# EAGLE design EVGP_Estop_Motherboard (EAGLE 9.5.1)
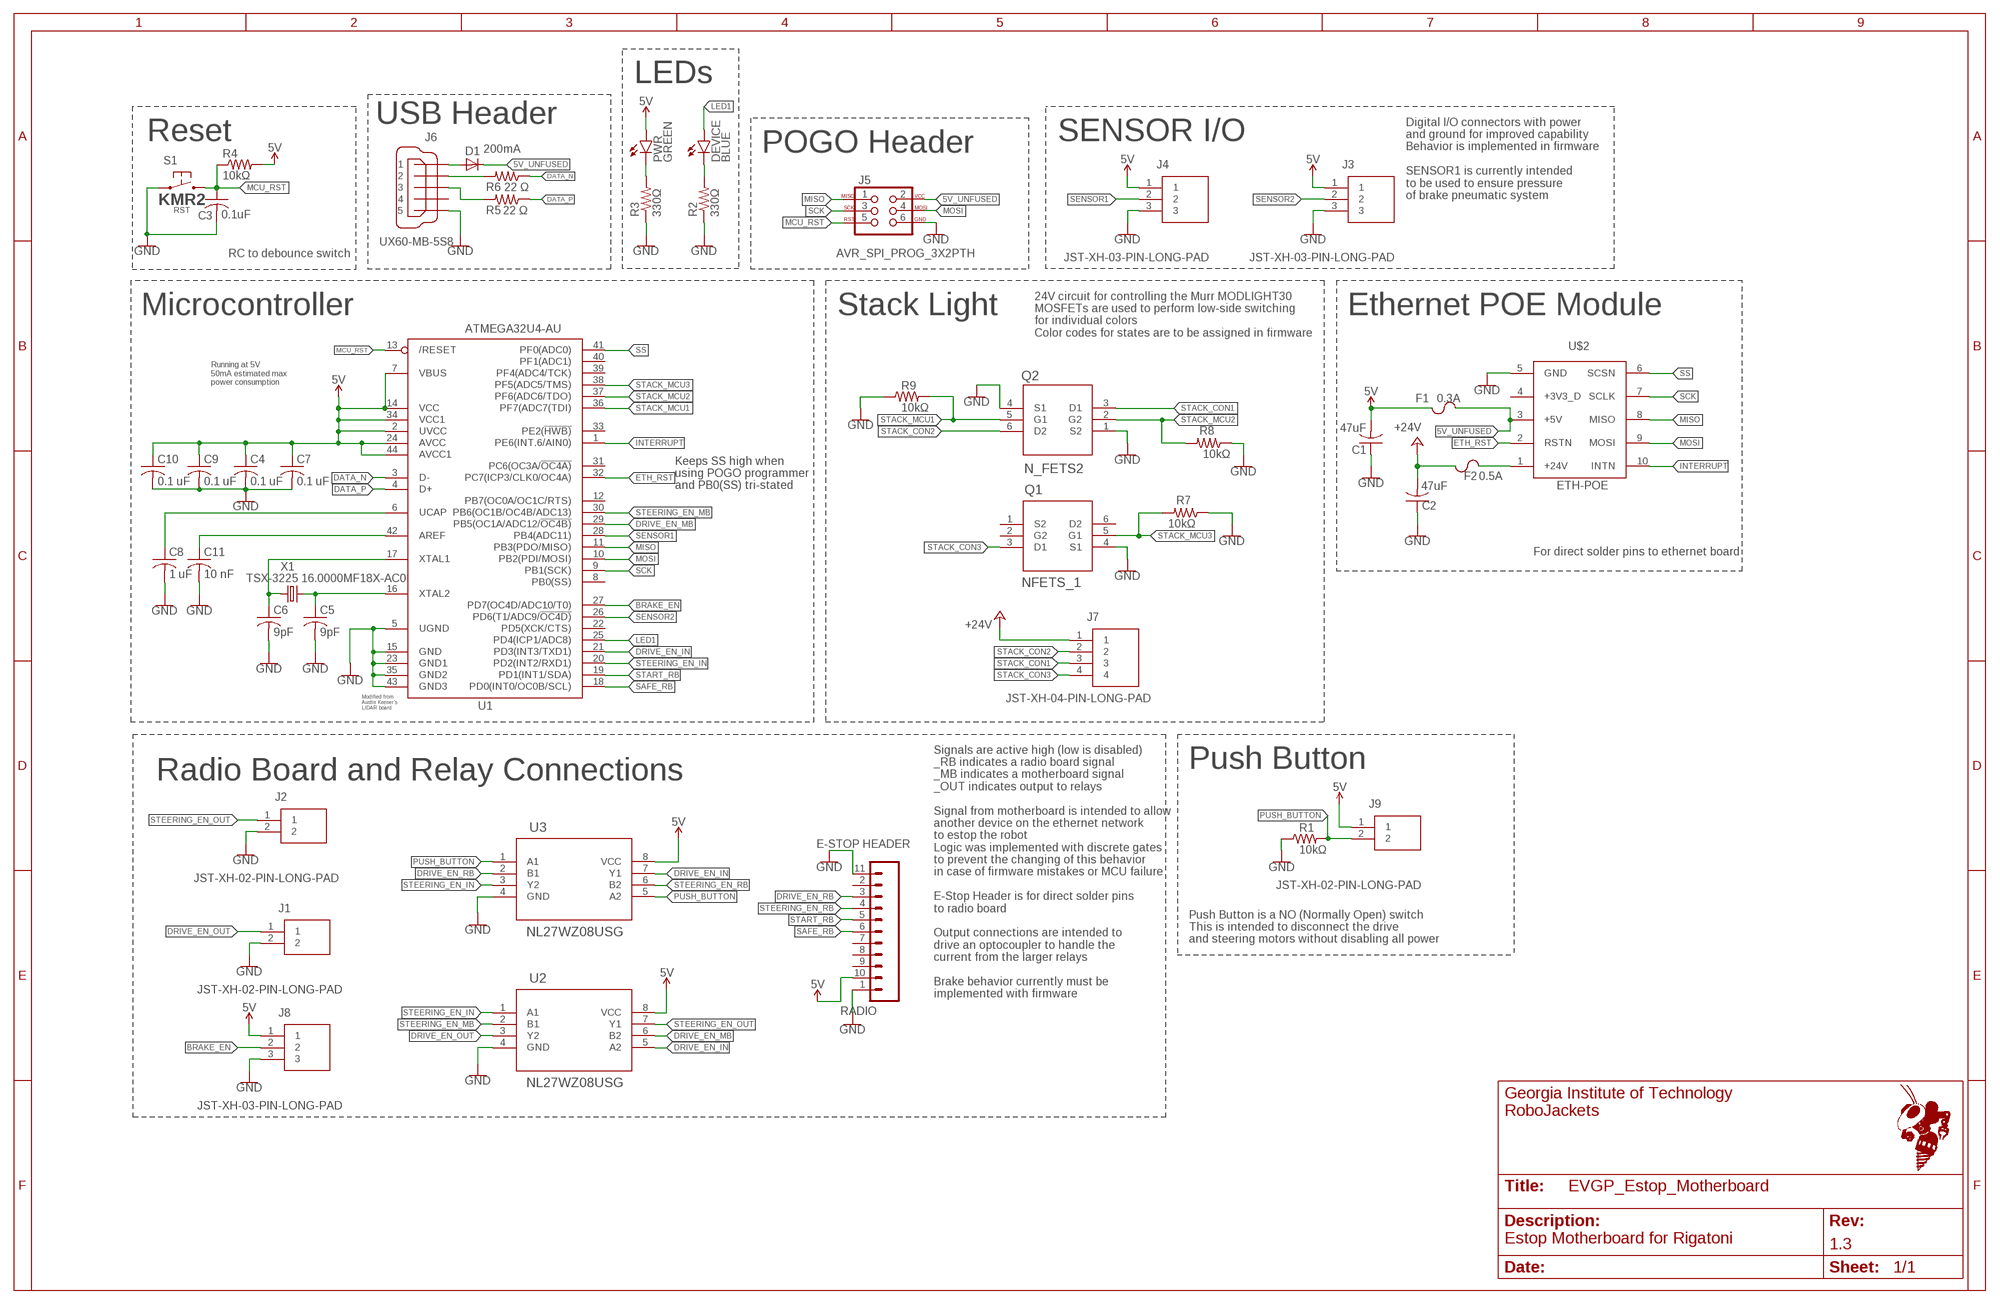
[diagram p0: schematic, sheet 1]
FRAME1 (FRAME_B_L): REVISION: 1.0; SCH_DESC: EVGP Steering Control Board
FRAME2 (FRAME_B_L): REVISION: 1.3; SCH_DESC: EVGP EStop Motherboard

## Parts
C1  47uF  C-USC1206  [C1206]
C2  47uF  C-USC1206  [C1206]
C3  0.1uF  C-USC0603  [C0603]
C4  0.1 uF  C-USC0603  [C0603]
C5  9pF  C-USC0603  [C0603]
C6  9pF  C-USC0603  [C0603]
C7  0.1 uF  C-USC0603  [C0603]
C8  1 uF  C-USC0603  [C0603]
C9  0.1 uF  C-USC0603  [C0603]
C10  0.1 uF  C-USC0603  [C0603]
C11  10 nF  C-USC0603  [C0603]
D1  200mA  DIODE-SOD323-R  [SOD323-R]
DEVICE  BLUE  LEDCHIP-LED0603  [CHIP-LED0603]
F1  0.3A  CHIP_FUSE1206  [F1206]
F2  0.5A  CHIP_FUSE1206  [F1206]
J1  JST-XH-02-PIN-LONG-PAD  [JST-XH-02-PACKAGE-LONG-PAD]
J2  JST-XH-02-PIN-LONG-PAD  [JST-XH-02-PACKAGE-LONG-PAD]
J3  JST-XH-03-PIN-LONG-PAD  [JST-XH-03-PACKAGE-LONG-PAD]
J4  JST-XH-03-PIN-LONG-PAD  [JST-XH-03-PACKAGE-LONG-PAD]
J5  AVR_SPI_PROG_3X2PTH  [2X3]
J6  UX60-MB-5S8  [UX60-MB-5S8]
J7  JST-XH-04-PIN-LONG-PAD  [JST-XH-04-PACKAGE-LONG-PAD]
J8  JST-XH-03-PIN-LONG-PAD  [JST-XH-03-PACKAGE-LONG-PAD]
J9  JST-XH-02-PIN-LONG-PAD  [JST-XH-02-PACKAGE-LONG-PAD]
PWR  GREEN  LEDCHIP-LED0603  [CHIP-LED0603]
Q1  NFETS_1  BSS84DW-7-F  [SOT-363]
Q2  N_FETS2  BSS84DW-7-F  [SOT-363]
R1  10kΩ  R-US_R0603  [R0603]
R2  330Ω  R-US_R0603  [R0603]
R3  330Ω  R-US_R0603  [R0603]
R4  10kΩ  R-US_R0603  [R0603]
R5  22 Ω  R-US_R0603  [R0603]
R6  22 Ω  R-US_R0603  [R0603]
R7  10kΩ  R-US_R0603  [R0603]
R8  10kΩ  R-US_R0603  [R0603]
R9  10kΩ  R-US_R0603  [R0603]
RADIO  E-STOP HEADER  ESTOP_RADIO  [RADIO_V1.3]
S1  KMR2  [KMR2]
U1  ATMEGA32U4-AU  [TQFP44]
U2  NL27WZ08USG  [US8_2P40X2P10]
U3  NL27WZ08USG  [US8_2P40X2P10]
U$2  ETH-POE  [HDRVR10W64P4000X254_2X5_1016X508X254B]
X1  TSX-3225 16.0000MF18X-AC0  XTAL-3.2X2.5  [XTAL-3.2X2.5]

## Nets
5V [power]: C1.2 C4.1 C7.1 C9.1 C10.1 F1.1 J3.1 J4.1 J8.1 J9.1 PWR.A R4.2 RADIO.10(5V) U1.2(UVCC) U1.7(VBUS) U1.14(VCC) U1.24(AVCC) U1.34(VCC1) U1.44(AVCC1) U2.8(VCC) U3.8(VCC)
5V_UNFUSED [power]: D1.C F1.2 J5.2 U$2.3(+5V)
24V_UNFUSED: F2.2 U$2.1(+24V)
+24V: C2.2 F2.1 J7.1
AREF: C11.1 U1.42(AREF)
BRAKE_EN: J8.2 U1.27(PD7(OC4D/ADC10/T0))
DATA_N [RF]: R6.1 U1.3(D-)
DATA_P [RF]: R5.1 U1.4(D+)
DRIVE_EN_IN: U1.21(PD3(INT3/TXD1)) U2.5(A2) U3.7(Y1)
DRIVE_EN_MB: U1.29(PB5(OC1A/ADC12/!OC4B)) U2.6(B2)
DRIVE_EN_OUT: J1.1 U2.3(Y2)
DRIVE_EN_RB: RADIO.3(D1) U3.2(B1)
ETH_RST: U1.32(PC7(ICP3/CLK0/OC4A)) U$2.2(RSTN)
GND [power]: C1.1 C2.1 C3.2 C4.2 C5.2 C6.2 C7.2 C8.2 C9.2 C10.2 C11.2 J1.2 J2.2 J3.3 J4.3 J5.6 J6.5 J8.3 Q1.4(S1) Q2.1(S2) Q2.4(S1) R1.1 R2.1 R3.1 R7.1 R8.1 R9.1 RADIO.1(GND) RADIO.11(GND) S1.1.1 S1.1.2 U1.5(UGND) U1.15(GND) U1.23(GND1) U1.35(GND2) U1.43(GND3) U2.4(GND) U3.4(GND) U$2.5(GND)
INTERRUPT: U1.1(PE6(INT.6/AIN0)) U$2.10(INTN)
LED1: DEVICE.A U1.25(PD4(ICP1/ADC8))
MCU_RST: C3.1 J5.5 R4.1 S1.2.1 S1.2.2 U1.13(/RESET)
MISO: J5.1 U1.11(PB3(PDO/MISO)) U$2.8(MISO)
MOSI: J5.4 U1.10(PB2(PDI/MOSI)) U$2.9(MOSI)
N$3: PWR.C R3.2
N$5: J6.2 R6.2
N$6: DEVICE.C R2.2
N$7: D1.A J6.1
N$11: J6.3 R5.2
PUSH_BUTTON: J9.2 R1.2 U3.1(A1) U3.5(A2)
SAFE_RB: RADIO.6(D4) U1.18(PD0(INT0/OC0B/SCL))
SCK: J5.3 U1.9(PB1(SCK)) U$2.7(SCLK)
SENSOR1: J4.2 U1.28(PB4(ADC11))
SENSOR2: J3.2 U1.26(PD6(T1/ADC9/!OC4D))
SS: U1.41(PF0(ADC0)) U$2.6(SCSN)
STACK_CON1: J7.3 Q2.3(D1)
STACK_CON2: J7.2 Q2.6(D2)
STACK_CON3: J7.4 Q1.3(D1)
STACK_MCU1: Q2.5(G1) R9.2 U1.36(PF7(ADC7(TDI))
STACK_MCU2: Q2.2(G2) R8.2 U1.37(PF6(ADC6/TDO))
STACK_MCU3: Q1.5(G1) R7.2 U1.38(PF5(ADC5/TMS))
START_RB: RADIO.5(D3) U1.19(PD1(INT1/SDA))
STEERING_EN_IN: U1.20(PD2(INT2/RXD1)) U2.1(A1) U3.3(Y2)
STEERING_EN_MB: U1.30(PB6(OC1B/OC4B/ADC13)) U2.2(B1)
STEERING_EN_OUT: J2.1 U2.7(Y1)
STEERING_EN_RB: RADIO.4(D2) U3.6(B2)
UCAP: C8.1 U1.6(UCAP)
XTAL1: C6.1 U1.17(XTAL1) X1.1
XTAL2: C5.1 U1.16(XTAL2) X1.3
Unconnected: J6.4 Q1.1(S2) Q1.2(G2) Q1.6(D2) RADIO.2(RST) RADIO.7(D5) RADIO.8(D6) RADIO.9(D7) U1.8(PB0(SS)) U1.12(PB7(OC0A/OC1C/RTS)) U1.22(PD5(XCK/CTS)) U1.31(PC6(OC3A/!OC4A)) U1.33(PE2(!HWB)) U1.39(PF4(ADC4/TCK)) U1.40(PF1(ADC1)) U$2.4(+3V3_D)

## Notes on the sheet
- LEDs
- Digital I/O connectors with power 
  and ground for improved capability
  Behavior is implemented in firmware
  
  SENSOR1 is currently intended 
  to be used to ensure pressure 
  of brake pneumatic system
- USB Header
- Reset | SENSOR I/O
- POGO Header
- RC to debounce switch
- 24V circuit for controlling the Murr MODLIGHT30
  MOSFETs are used to perform low-side switching
  for individual colors 
  Color codes for states are to be assigned in firmware
- Microcontroller | Stack Light | Ethernet POE Module
- Running at 5V
  50mA estimated max
  power consumption
- Keeps SS high when
  using POGO programmer
  and PB0(SS) tri-stated
- For direct solder pins to ethernet board
- Modified from 
  Austin Keener's 
  LIDAR board
- Signals are active high (low is disabled)
  _RB indicates a radio board signal
  _MB indicates a motherboard signal
  _OUT indicates output to relays
  
  Signal from motherboard is intended to allow
  another device on the ethernet network 
  to estop the robot
  Logic was implemented with discrete gates
  to prevent the changing of this behavior
  in case of firmware mistakes or MCU failure 
  
  E-Stop Header is for direct solder pins 
  to radio board
  
  Output connections are intended to 
  drive an optocoupler to handle the 
  current from the larger relays
  
  Brake behavior currently must be 
  implemented with firmware
- Push Button
- Radio Board and Relay Connections
- Push Button is a NO (Normally Open) switch
  This is intended to disconnect the drive 
  and steering motors without disabling all power
- Estop Motherboard for Rigatoni

## Library data of the parts
C1-C3 = rcl:C-US: CAPACITOR, American symbol; SPICEPREFIX: C
C4-C11 = resistor:C-US: CAPACITOR, American symbol
D1 = RoboJackets-Diodes:DIODE-: DIODE
DEVICE PWR = led:LED: LED OSRAM: - CHIPLED LG R971, LG N971, LY N971, LG Q971, LY Q971, LO R971, LY R971 LH N974, LH R974 LS Q976, LO Q976, LY Q976 LO Q996 - Hyper CHIPLED LW Q18S LB Q993, LB Q99A, LB R99A - SideLED LS A670, LO A670, LY A670, LG A670, LP A670 LB A673, LV A673, LT A673, LW A673 LH A674 LY A675 LS A676, LA A676, LO A676, LY A676, LW A676 LS A679, LY A679, LG A679 - Hyper Micro SIDELED® LS Y876, LA Y876, LO Y876, LY Y876 LT Y87S - SmartLED LW L88C, LW L88S LB L89C, LB L89S, LG L890 LS L89K, LO L89K, LY L89K LS L896, LA L896, LO L896, LY L896 - TOPLED LS T670, LO T670, LY T670, LG T670, LP T670 LSG T670, LSP T670, LSY T670, LOP T670, LYG T670 LG T671, LOG T671, LSG T671 LB T673, LV T673, LT T673, LW T673 LH T674 LS T676, LA T676, LO T676, LY T676, LB T676, LH T676, LSB T676, LW T676 LB T67C, LV T67C, LT T67C, LS T67K, LO T67K, LY T67K, LW E67C LS E67B, LA E67B, LO E67B, LY E67B, LB E67C, LV E67C, LT E67C LW T67C LS T679, LY T679, LG T679 LS T770, LO T770, LY T770, LG T770, LP T770 LB T773, LV T773, LT T773, LW T773 LH T774 LS E675, LA E675, LY E675, LS T675 LS T776, LA T776, LO T776, LY T776, LB T776 LHGB T686 LT T68C, LB T68C - Hyper Mini TOPLED® LB M676 - Mini TOPLED Santana® LG M470 LS M47K, LO M47K, LY M47K Source: http://www.osram.convergy.de LUXEON: - LUMILED® LXK2-PW12-R00, LXK2-PW12-S00, LXK2-PW14-U00, LXK2-PW14-V00 LXK2-PM12-R00, LXK2-PM12-S00, LXK2-PM14-U00 LXK2-PE12-Q00, LXK2-PE12-R00, LXK2-PE12-S00, LXK2-PE14-T00, LXK2-PE14-U00 LXK2-PB12-K00, LXK2-PB12-L00, LXK2-PB12-M00, LXK2-PB14-N00, LXK2-PB14-P00, LXK2-PB14-Q00 LXK2-PR12-L00, LXK2-PR12-M00, LXK2-PR14-Q00, LXK2-PR14-R00 LXK2-PD12-Q00, LXK2-PD12-R00, LXK2-PD12-S00 LXK2-PH12-R00, LXK2-PH12-S00 LXK2-PL12-P00, LXK2-PL12-Q00, LXK2-PL12-R00 Source: www.luxeon.com KINGBRIGHT: KA-3528ASYC Source: www.kingbright.com
F1 F2 = RoboJackets-Fuses:CHIP_FUSE
J1 J2 J9 = EVGP_Estop_Motherboard:JST-XH-02-PIN: JST XH Connector 2 Pin Wire to board connector. Pitch: 2,54 mm, (0.100") Number of pins: 2 Created by Rembrandt Electronics www.rembrandtelectronics.com
J3 J4 J8 = EVGP_Estop_Motherboard:JST-XH-03-PIN: JST XH Connector 2 Pin Wire to board connector. Pitch: 2,54 mm, (0.100") Number of pins: 3 Created by Rembrandt Electronics www.rembrandtelectronics.com
J5 = SparkFun-Connectors:AVR_SPI_PROG_3X2: AVR ISP 6 Pin This is the reduced ISP connector for AVR programming. Common on Arduino. This footprint will take up less PCB space and can be used with a 10-pin to 6-pin adapter such as SKU: BOB-08508 **Special note about "TEST_POINT" package. The stop mask is on the top side, so if you want your programming test points to be on the bottom of your board, make sure to place this package on the bottom side of the board. This also ensure that the orientation to program from the bottom side will be correct. SparkFun Products: SparkFun ISP Pogo Adapter <https://www.sparkfun.com/products/11591> - NS Tiny AVR Programmer <https://www.sparkfun.com/products/11801> -PTH
J6 = RoboJackets-Connectors:UX60*-MB-5S?: Mini USB Connector Brand: Hirose Electric Co Ltd <http://www.hirose.com/us/> Series: UX <http://www.digikey.com/product-search/en?FV=fff40016,fff802e4,ffec3225> Distributor: Digi-Key <http://www.digikey.com/product-detail/en/UX60A-MB-5ST/H2961CT-ND/597540>; PINS: 5
J7 = EVGP_Estop_Motherboard:JST-XH-04-PIN: JST XH Connector 2 Pin Wire to board connector. Pitch: 2,54 mm, (0.100") Number of pins: 4 Created by Rembrandt Electronics www.rembrandtelectronics.com
Q1 Q2 = EVGP_Estop_Daughterboard:BSS84DW-7-F: dual mosfet; MANUFACTURER_PART_NUMBER: BSS84DW7F; VENDOR: Diodes Inc
R1-R9 = rcl:R-US_: RESISTOR, American symbol; SPICEPREFIX: R
RADIO = board_outline:ESTOP_RADIO
S1 = RoboJackets-Switches:KMR2; FUNCTION: RST
U1 = estop-v1.0:ATMEGA32U4: http://www.ladyada.net/library/eagle
U2 U3 = EVGP_Estop_Motherboard:NL27WZ08USG; MANUFACTURER_PART_NUMBER: NL27WZ08USG; VENDOR: ON Semiconductor
U$2 = ethernet_poe:ETH-POE: POE
X1 = RoboJackets-FreqGen:XTAL

## Net classes
0 default: width 0.203 mm, drill 0.508 mm, clearance 0.178 mm
1 power: width 0.305 mm, drill 0.508 mm, clearance 0.178 mm
2 RF: width 0.203 mm, clearance 0.178 mm

## Board
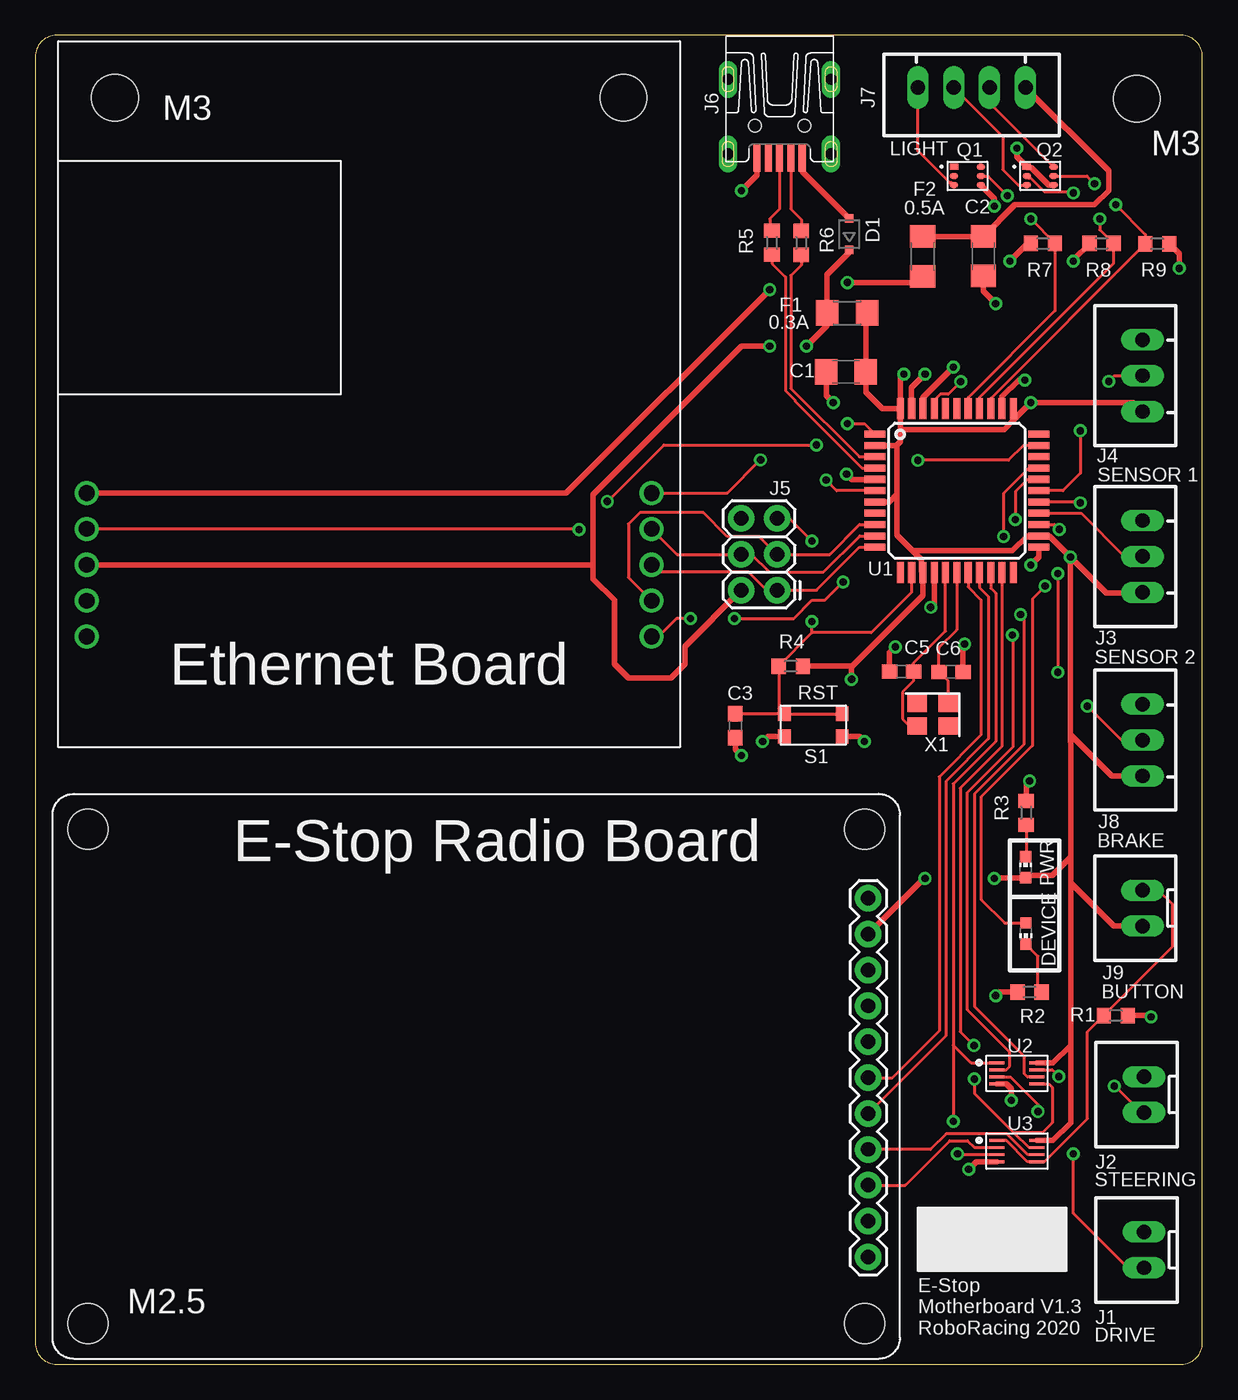
[diagram p1: board, top side]
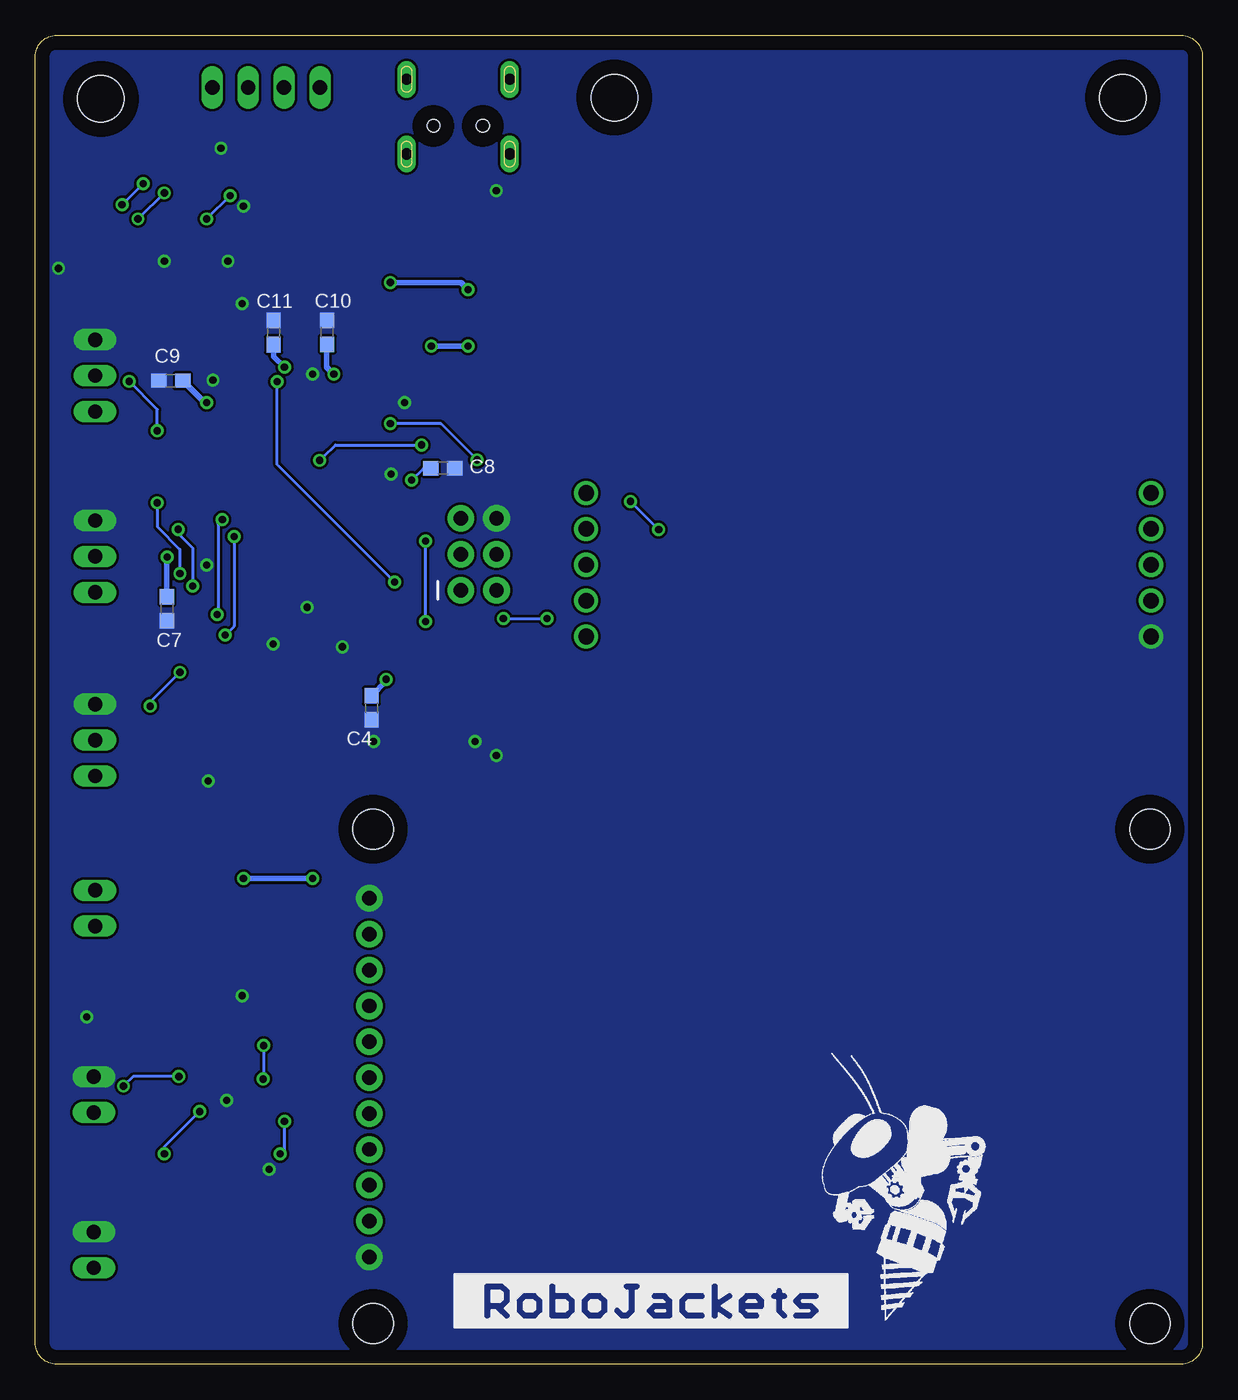
[diagram p2: board, bottom side, seen from below]

Size 82.64 x 94.09 mm. Coordinates in mm from the lower left corner, seen from the top.
Outline: 0,92.59 0,1.5 arc90 1.5,0 81.14,0 arc90 82.64,1.5 82.64,92.59 arc90 81.14,94.09 1.5,94.09 arc90 0,92.59
Copper layers (1*16): Top 0.035mm / dielectric 1.5mm / Bottom 0.035mm
Design rules "default": minimum track width 6mil, minimum drill 0.35mm, track to track 6mil, track to pad 6mil, pad to pad 6mil, via to via 6mil, smd to smd 6mil, copper to edge 40mil, drill to drill 6mil, minimum pad ring 10mil, minimum via ring 8mil, stop-mask expansion 4mil, vias tented up to drill 0mil, thermal gap 10mil
Holes 3.3 mm at 78,89.59

### Footprints (pad centres in the part's own frame; a part is rotated, then mirrored left to right if it is on the bottom)
C1206 = smd 1.6 x 1.8: 1 -1.4,0; 2 1.4,0
C0603 = smd 1.1 x 1: 1 -0.85,0; 2 0.85,0
SOD323-R = smd 0.6 x 0.6: A 1.1,0; C -1.1,0
CHIP-LED0603 = smd 0.8 x 0.8: A 0,-0.75; C 0,0.75
F1206 = smd 1.6 x 1.803: 1 -1.422,0; 2 1.422,0
JST-XH-02-PACKAGE-LONG-PAD = drill 1.016 long: 1 -1.27,0; 2 1.27,0
JST-XH-03-PACKAGE-LONG-PAD = drill 1.016 long: 1 -2.54,0; 2 0,0; 3 2.54,0
2X3 = drill 1.016 pad 1.88: 1 0,0; 2 0,2.54; 3 2.54,0; 4 2.54,2.54; 5 5.08,0; 6 5.08,2.54
UX60-MB-5S8 = smd 2 x 0.5: 1 8.65,1.6; 2 8.65,0.8; 3 8.65,0; 4 8.65,-0.8; 5 8.65,-1.6 | drill 0.8 long: M1 3.1,-3.65; M2 3.1,3.65; M3 8.4,3.65; M4 8.4,-3.65 | hole 0.9: 6.4,-1.75; 6.4,1.75
JST-XH-04-PACKAGE-LONG-PAD = drill 1.016 long: 1 -3.81,0; 2 -1.27,0; 3 1.27,0; 4 3.81,0
SOT-363 = smd 0.6 x 0.42: 1 -0.95,0.65; 2 -0.95,0; 3 -0.95,-0.65; 4 0.95,-0.65; 5 0.95,0; 6 0.95,0.65
R0603 = smd 1 x 1.1: 1 -0.85,0; 2 0.85,0
RADIO_V1.3 = drill 1.016 pad 1.88: 1 57.76,7.21; 2 57.76,9.75; 3 57.76,12.29; 4 57.76,14.83; 5 57.76,17.37; 6 57.76,19.91; 7 57.76,22.45; 8 57.76,24.99; 9 57.76,27.53; 10 57.76,30.07; 11 57.76,32.61 | hole 2.85: 2.5,2.5; 57.5,2.5; 2.5,37.5; 57.5,37.5
KMR2 = smd 0.9 x 1: 1.1 -2.05,0.8; 1.2 2.05,0.8; 2.1 -2.05,-0.8; 2.2 2.05,-0.8
TQFP44 = smd 1.5 x 0.5: 1 -5.8,4; 2 -5.8,3.2; 3 -5.8,2.4; 4 -5.8,1.6; 5 -5.8,0.8; 6 -5.8,0; 7 -5.8,-0.8; 8 -5.8,-1.6; 9 -5.8,-2.4; 10 -5.8,-3.2; 11 -5.8,-4; 23 5.8,-4; 24 5.8,-3.2; 25 5.8,-2.4; 26 5.8,-1.6; 27 5.8,-0.8; 28 5.8,0; 29 5.8,0.8; 30 5.8,1.6; 31 5.8,2.4; 32 5.8,3.2; 33 5.8,4 | smd 0.5 x 1.5: 12 -4,-5.8; 13 -3.2,-5.8; 14 -2.4,-5.8; 15 -1.6,-5.8; 16 -0.8,-5.8; 17 0,-5.8; 18 0.8,-5.8; 19 1.6,-5.8; 20 2.4,-5.8; 21 3.2,-5.8; 22 4,-5.8; 34 4,5.8; 35 3.2,5.8; 36 2.4,5.8; 37 1.6,5.8; 38 0.8,5.8; 39 0,5.8; 40 -0.8,5.8; 41 -1.6,5.8; 42 -2.4,5.8; 43 -3.2,5.8; 44 -4,5.8
US8_2P40X2P10 = smd 1.067 x 0.203: 1 -1.422,0.75; 2 -1.422,0.25; 3 -1.422,-0.25; 4 -1.422,-0.75; 5 1.422,-0.75; 6 1.422,-0.25; 7 1.422,0.25; 8 1.422,0.75
HDRVR10W64P4000X254_2X5_1016X508X254B = drill 1.105 pad 1.705: 1 2,18; 2 2,15.46; 3 2,12.92; 4 2,10.38; 5 2,7.84; 6 42,7.84; 7 42,10.38; 8 42,12.92; 9 42,15.46; 10 42,18 | hole 3.3: 4,46; 40,46
XTAL-3.2X2.5 = smd 1.4 x 1.2: 1 -1.1,-0.8; 2 1.1,-0.8; 3 1.1,0.8; 4 -1.1,0.8

### Placement (x,y rotation side)
C1  57.4,70.26 0 top
C2  67.13,78.45 90 top
C3  49.56,45.19 270 top
C4  58.84,46.47 270 bottom
C5  61.34,49.04 180 top
C6  64.84,49.02 0 top
C7  73.32,53.49 270 bottom
C8  53.77,63.43 0 bottom
C9  73.04,69.63 180 bottom
C10  61.97,73.06 90 bottom
C11  65.76,73.04 90 bottom
D1  57.63,80.01 90 top
DEVICE  70.14,30.49 180 top
F1  57.48,74.42 180 top
F2  62.83,78.43 270 top
J1  78.5,8.09 90 top
J2  78.5,19.09 90 top
J3  78.4,57.19 90 top
J4  78.4,69.99 90 top
J5  52.52,54.8 90 top
J6  52.7,94.08 270 top
J7  66.3,90.39 180 top
J8  78.4,44.19 90 top
J9  78.4,32.29 90 top
PWR  70.12,35.19 0 top
Q1  66,84.13 0 top
Q2  71.15,84.13 0 top
R1  76.5,24.69 180 top
R2  70.4,26.35 0 top
R3  70.16,39.04 270 top
R4  53.49,49.43 0 top
R5  52.16,79.4 90 top
R6  54.24,79.39 90 top
R7  71.35,79.35 0 top
R8  75.5,79.35 0 top
R9  79.45,79.33 180 top
RADIO  1.22,0.38 0 top
S1  55.09,45.25 180 top
U1  65.25,61.85 0 top
U2  69.5,20.59 0 top
U3  69.5,15.09 0 top
U$1  [ROBOBUZZ_1.0X]  22.5,3.09 0 bottom
U$2  1.64,43.68 0 top
U$3  [ROBOJACKETS]  53,2.59 0 bottom
X1  63.54,45.99 180 top

### Tracks (layer width: path | path; a pad name or v marks a point on that pad's centre or on a via)
5V  (via drill 0.51)
  Top 0.406: U1.44 59.97,67.65 58.8,68.82 C1.2 58.8,74.32 F1.1 | 57.84,49.43 R4.2 | U1.44 61.25,69.84 v61.5,70.09 | U1.44 61.25,66.19 | 61.25,66.19 61.25,65.34 60.96,65.05 | U1.2 60.96,65.05 | 60.96,65.05 61,65.01 61,61.59 | 61,61.59 60.46,61.05 U1.7 | 61.25,66.19 68.6,66.19 69.25,66.84 | 69.25,66.84 U1.34 | 61,61.59 61,58.71 62.11,57.6 | 62.11,57.6 62.73,56.98 62.73,56.17 U1.14 62.85,54.44 57.84,49.43 | 62.11,57.6 69.19,57.6 70.24,58.65 U1.24 71.79,58.65 v73.3,57.14 | 69.25,66.84 v70.5,68.09 77.76,68.09 J4.1 | v63,34.39 62.92,34.39 RADIO.10 | v67.9,34.39 67.95,34.44 PWR.A 70.27,34.59 72,34.59 73.31,35.9 | 73.31,35.9 73.31,34.09 | 57.84,49.43 57.8,49.39 v57.8,48.49 | 73.3,44.59 73.3,44.1 73.31,44.09 73.31,36.09 73.31,35.9 | 73.3,44.59 76.24,41.65 J8.1 | 73.31,22.59 73.31,34.09 | v73.3,57.14 73.3,44.59 | v73.3,57.14 75.85,54.59 78.34,54.59 J3.1 | U3.8 72.05,15.84 73.31,17.1 73.31,22.59 | U2.8 72.06,21.34 73.31,22.59 | J9.1 76.38,31.02 73.31,34.09
  Bottom 0.406: v70.5,68.09 70.65,68.09 C9.1 | v57.8,48.49 57.8,48.36 C4.1 | v61.5,70.09 62,70.59 62,72.18 C10.1 | v67.9,34.39 v63,34.39 | v73.3,57.14 73.32,57.12 C7.1
5V_UNFUSED  (via drill 0.51)
  Top 0.406: v54.6,72.09 56.06,73.55 F1.2 56.06,77.15 57.63,78.72 D1.C | 39.49,56.6 U$2.3 | J5.2 46,50.82 46,49.59 45,48.59 42,48.59 41,49.59 41,54.09 39.49,55.6 39.49,56.6 | v52,72.09 50,72.09 39.49,61.58 39.49,56.6
  Bottom 0.406: v54.6,72.09 v52,72.09
24V_UNFUSED  (via drill 0.51)
  Top 0.406: F2.2 62.41,76.59 v57.5,76.59 | v52,76.09 37.59,61.68 U$2.1
  Bottom 0.406: v57.5,76.59 52.5,76.59 v52,76.09
+24V
  Top 0.406: F2.1 C2.2 69.37,82.09 75,82.09 76,83.09 76,84.5 J7.1
AREF  (via drill 0.51)
  Top 0.406: U1.42 62.85,68.44 v65,70.59
  Bottom 0.406: v65,70.59 65.76,71.35 C11.1
BRAKE_EN  (via drill 0.51)
  Top 0.203: v72.4,55.99 v72.4,48.99 | v74.5,46.59 76.9,44.19 J8.2 | v74,60.99 73.94,61.05 U1.27
  Bottom 0.203: v74,60.99 74,59.29 72.4,57.69 v72.4,55.99 | v74.5,46.59 74.5,46.89 v72.4,48.99
DATA_N
  Top 0.203: U1.3 58.34,64.25 53.5,69.09 53.5,77.09 54.24,77.83 R6.1
DATA_P
  Top 0.203: U1.4 58.54,63.45 53.8,68.19 53.8,68.25 53.12,68.93 53.12,76.97 52.16,77.93 R5.1
DRIVE_EN_IN  (via drill 0.51)
  Top 0.203: U1.21 68.45,43.74 65.5,40.79 65.5,23.53 v66.47,22.56 | 69.3,16.39 70.35,15.34 U3.7 | 69.3,16.39 66.5,19.19 v66.5,20.19 | U2.5 71.75,19.84 72,19.59 72,17.09 71.3,16.39 69.3,16.39
  Bottom 0.203: v66.47,22.56 66.47,20.22 v66.5,20.19
DRIVE_EN_MB  (via drill 0.51)
  Top 0.203: U1.29 70.99,62.59 70.2,62.59 69.4,61.79 v69.4,59.79 | v69.76,53.08 70,52.85 70,43.89 66.5,40.39 66.5,25.33 70,21.83 70,20.59 70.25,20.34 U2.6
  Bottom 0.203: v69.4,59.79 69.7,59.49 69.7,53.15 v69.76,53.08
DRIVE_EN_OUT  (via drill 0.51)
  Top 0.203: U2.3 69.05,20.34 71,18.39 v71,17.89 | J1.1 77.37,6.82 73.5,10.69 v73.5,14.89
  Bottom 0.203: v73.5,14.89 73.5,15.39 v71,17.89
DRIVE_EN_RB
  Top 0.203: RADIO.3 61.6,12.67 64.75,15.83 66,15.83 66.49,15.34 U3.2
ETH_RST  (via drill 0.51)
  Top 0.203: U1.32 69.96,65.05 68.91,64 v62.5,64 | v38.5,59.09 38.45,59.14 U$2.2 | v40.5,61.09 44.5,65.09 v55.3,65.09
  Bottom 0.203: v62.5,64 62.19,64.3 62.17,64.3 61.39,65.09 v55.3,65.09 | v38.5,59.09 v40.5,61.09
GND  (via drill 0.51)
  Top 0.406: C3.2 49.56,43.53 v50,43.09 | S1.1.2 51.86,44.45 v51.5,44.09 | S1.1.1 58.34,44.45 v58.7,44.09 | R3.1 70.16,41.05 v70.4,41.29 | R2.1 68.26,26.35 v68,26.09 | v65.8,50.99 65.69,50.88 C6.2 | C5.2 60.49,50.38 v60.9,50.79 | U1.23 71.05,57.14 v70.5,56.59 | U1.35 68.45,68.5 69.64,69.68 v70.07,69.68 | U1.43 62.05,69.14 v63,70.09 | U1.5 57.83,62.65 v57.44,63.03 | R7.1 70.26,79.35 v69,78.09 | R8.1 73.5,78.2 v73.5,78.09 | C1.1 56,68.59 v56.5,68.09 | C2.1 67.13,75.96 v68,75.09 | R9.1 81,78.63 v81,77.59 | v50,83.09 51.1,84.19 J6.5 | Q1.4 67.9,82.53 v67.9,81.99 | v69.5,86.09 69.5,85.48 Q2.1 70.26,84.72 70.53,84.72 71.78,83.48 Q2.4 | v63.4,53.59 63.65,53.84 U1.15 | U3.4 66.63,14.34 v66.09,13.8 | U2.4 68.75,19.84 69.1,19.49 v69.1,18.69 | R1.1 78.9,24.69 v79,24.59
  pour Bottom (no thermals): 0.5,93.59 82.5,93.59 82.5,0.09 0.5,0.09
INTERRUPT  (via drill 0.51)
  Top 0.203: U$2.10 49,61.68 v51.36,64.03 | v57.5,66.59 58.71,66.59 U1.1
  Bottom 0.203: v51.36,64.03 53.91,66.59 v57.5,66.59
LED1  (via drill 0.51)
  Top 0.203: DEVICE.A 68.64,31.23 67,32.88 67,40.19 70.6,43.79 70.6,54.19 v71.5,55.09 | U1.25 72.17,59.45 v72.52,59.11
  Bottom 0.203: v72.52,59.11 72.52,58.81 71.5,57.79 v71.5,55.09
MCU_RST  (via drill 0.51)
  Top 0.203: C3.1 S1.2.2 | U1.13 62.05,54.64 59.2,51.79 55,51.79 | S1.2.2 52.64,46.45 R4.1 55,51.79 | S1.2.2 S1.2.1 | 55,51.79 v55,52.59 | v55,58.29 53.41,59.88 J5.5
  Bottom 0.203: v55,52.59 v55,58.29
MISO
  Top 0.203: U1.11 58.36,57.85 55.31,54.8 J5.1 51.78,54.8 50.51,56.07 44.17,56.07 U$2.8
MOSI
  Top 0.203: U1.10 58.38,58.65 55.8,56.07 51.99,56.07 50.72,57.34 J5.4 45.44,57.34 U$2.9
N$3
  Top 0.203: R3.2 70.16,35.98 PWR.C
N$5
  Top 0.203: J6.2 53.5,81.79 54.24,81.05 R6.2
N$6
  Top 0.203: R2.2 71,26.6 71,28.88 DEVICE.C
N$7
  Top 0.406: D1.A 54.3,84.44 J6.1
N$11
  Top 0.203: J6.3 52.7,81.79 52,81.09 52,80.41 R5.2
PUSH_BUTTON
  Top 0.203: U3.1 68.75,15.84 70.25,14.34 U3.5 70.94,14.36 71.47,14.36 74.5,17.39 74.5,23.54 R1.2 80.5,29.54 80.5,32.59 79.53,33.56 J9.2
SAFE_RB
  Top 0.203: RADIO.6 60.7,20.29 64,23.59 64,41.59 66.97,44.56 66.97,54.12 66.05,55.04 U1.18
SCK
  Top 0.203: U1.9 58.36,59.45 56.25,57.34 J5.3 51.25,58.61 48.98,58.61 47.29,60.3 42.81,60.3 42,59.49 42,55.7 U$2.7
SENSOR1  (via drill 0.51)
  Top 0.203: v74,66.09 74,63.09 72.76,61.85 U1.28 | v76,69.59 76.4,69.99 J4.2
  Bottom 0.203: v74,66.09 74,67.59 v76,69.59
SENSOR2
  Top 0.203: U1.26 74.06,60.25 77.12,57.19 J3.2
SS  (via drill 0.51)
  Top 0.203: U$2.6 44.14,51.52 45.41,52.79 v46.4,52.79 | v57.2,55.39 55.9,54.09 55,54.09 53.7,52.79 v49.5,52.79 | v65.52,69.57 64.63,68.68 64.08,68.68 63.65,68.25 U1.41
  Bottom 0.203: v49.5,52.79 v46.4,52.79 | v57.2,55.39 65.5,63.69 65.5,69.55 v65.52,69.57
STACK_CON1
  Top 0.203: J7.3 68.5,86.92 68.5,84.59 69.61,83.48 Q2.3
STACK_CON2
  Top 0.203: Q2.6 67.57,89.31 J7.2
STACK_CON3
  Top 0.203: Q1.3 64.89,83.64 64.76,83.64 62.49,85.91 J7.4
STACK_MCU1  (via drill 0.51)
  Top 0.203: U1.36 67.65,68.38 R9.2 78.6,79.99 v76.5,82.09 | v75,83.59 74.46,84.13 Q2.5
  Bottom 0.203: v75,83.59 v76.5,82.09
STACK_MCU2  (via drill 0.51)
  Top 0.203: U1.37 66.85,68.44 76.35,77.94 R8.2 75.37,80.33 v75.37,81.09 | v73.5,82.93 73.44,82.99 71.47,82.99 70.49,83.97 70.36,83.97 Q2.2
  Bottom 0.203: v73.5,82.93 75.34,81.09 v75.37,81.09
STACK_MCU3  (via drill 0.51)
  Top 0.203: U1.38 66.05,68.44 72.2,74.59 R7.2 72.2,79.39 v70.5,81.09 | v68.84,82.74 67.45,84.13 Q1.5
  Bottom 0.203: v68.84,82.74 v70.49,81.09 v70.5,81.09
START_RB
  Top 0.203: U1.19 66.85,55 67.5,54.35 67.5,44.29 64.5,41.29 64.5,23.29 58.98,17.77 RADIO.5
STEERING_EN_IN  (via drill 0.51)
  Top 0.203: U1.20 67.65,54.94 68,54.59 68,44.09 65,41.09 65,22.59 | U2.1 66.25,21.34 65,22.59 | 65,22.59 v65,17.19 | U3.3 65.35,14.84 v65.3,14.89
  Bottom 0.203: v65.3,14.89 65,15.19 v65,17.19
STEERING_EN_MB  (via drill 0.51)
  Top 0.203: U1.30 70.36,63.45 68.56,61.65 v68.56,58.59 | v69.19,51.62 69.2,51.6 69.2,43.69 66,40.49 66,25.09 69,22.09 69,21.09 68.75,20.84 U2.2
  Bottom 0.203: v69.19,51.62 68.56,52.25 v68.56,58.59
STEERING_EN_OUT  (via drill 0.51)
  Top 0.203: J2.1 78.3,17.82 76.43,19.69 v76.4,19.69 | U2.7 72,20.84 v72.47,20.37
  Bottom 0.203: v72.47,20.37 75.72,20.37 v76.4,19.69
STEERING_EN_RB
  Top 0.203: U3.6 70.29,14.84 68.81,16.32 64.51,16.32 63.39,15.2 RADIO.4
UCAP  (via drill 0.51)
  Top 0.203: U1.6 56.74,61.85 v56,62.59
  Bottom 0.203: C8.1 55.16,63.43 v56,62.59
XTAL1
  Top 0.203: U1.17 65.25,51.99 63.99,50.73 C6.1 64.64,48.37 X1.1
XTAL2
  Top 0.203: U1.16 64.45,51.9 62.19,49.64 C5.1 62.19,48.38 61.4,47.59 61.4,45.69 61.9,45.19 X1.3

### Text on the board
tPlace: M3 | M3 | 0.5A | 0.3A | Ethernet Board | E-Stop Radio Board | M2.5 | E-Stop / Motherboard V1.3 / RoboRacing 2020
tNames: LIGHT | SENSOR 1 | SENSOR 2 | BRAKE | BUTTON | STEERING | DRIVE